# EAGLE design avr002 (EAGLE 6.5.0)
test
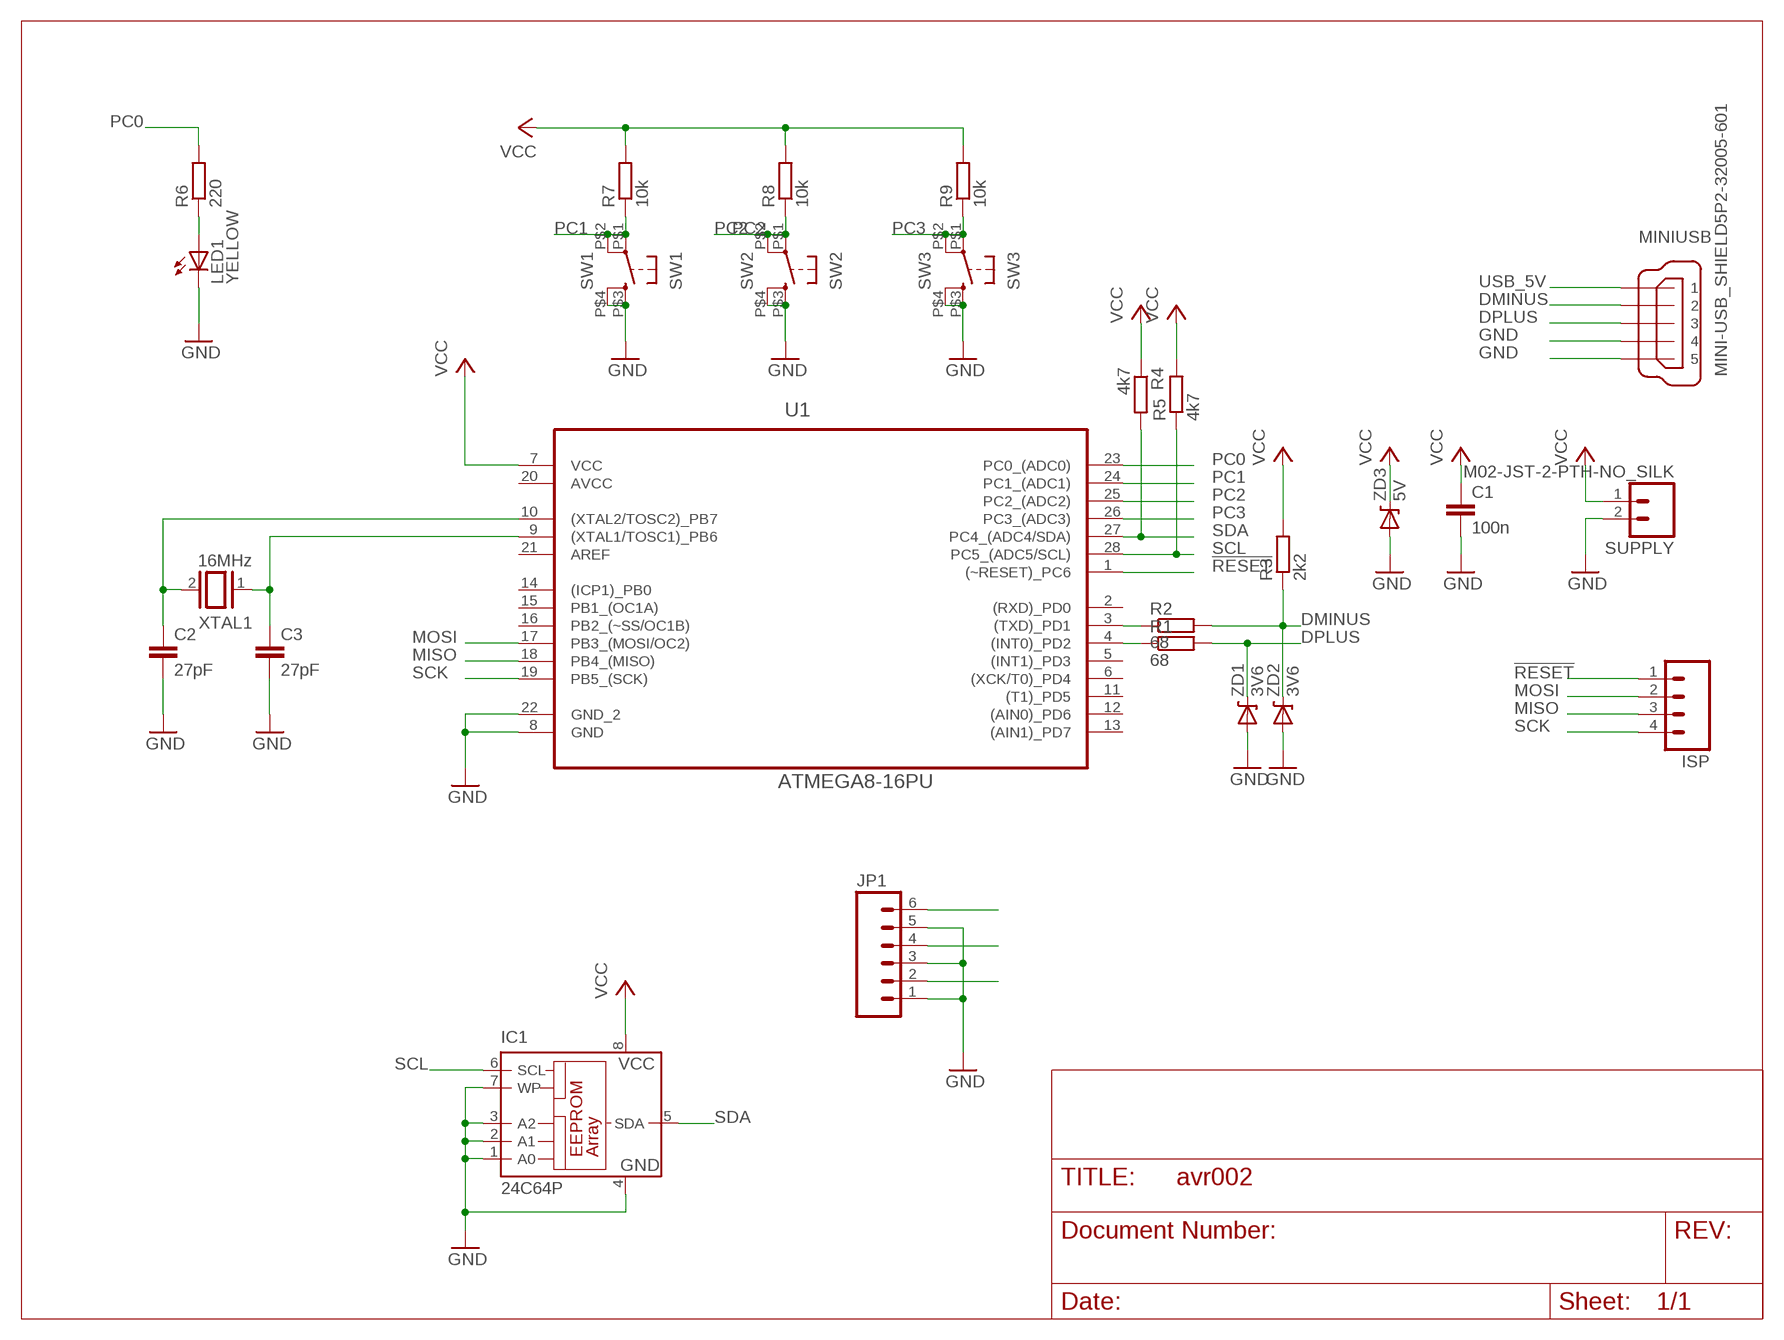
[diagram p0: schematic, sheet 1]

## Parts
C1  100n  C-EU050-024X044  [C050-024X044]
C2  27pF  C-EU050-024X044  [C050-024X044]
C3  27pF  C-EU050-024X044  [C050-024X044]
IC1  24C64P  [DIL8]
ISP  M04POLAR  [MOLEX-1X4]
JP1  M06POLAR  [MOLEX-1X6]
LED1  YELLOW  LED5MM  [LED5MM]
MINIUSB  MINI-USB_SHIELD5P2-32005-601  [32005-601]
R1  68  R-EU_0204/7  [0204/7]
R2  68  R-EU_0204/7  [0204/7]
R3  2k2  R-EU_0204/7  [0204/7]
R4  4k7  R-EU_0204/7  [0204/7]
R5  4k7  R-EU_0204/7  [0204/7]
R6  220  R-EU_0204/7  [0204/7]
R7  10k  R-EU_0204/7  [0204/7]
R8  10k  R-EU_0204/7  [0204/7]
R9  10k  R-EU_0204/7  [0204/7]
SUPPLY  M02-JST-2-PTH-NO_SILK  [JST-2-PTH-NS]
SW1  SW1  TAC_SWITCHKSA_SEALED  [KSA_SEALED_TAC_SWITCH]
SW2  SW2  TAC_SWITCHKSA_SEALED  [KSA_SEALED_TAC_SWITCH]
SW3  SW3  TAC_SWITCHKSA_SEALED  [KSA_SEALED_TAC_SWITCH]
U1  ATMEGA8-16PU  [DIP254P762X457-28]
XTAL1  16MHz  XTAL  [Q]
ZD1  3V6  DIODE-ZENERPTH  [DIODE-ZENER]
ZD2  3V6  DIODE-ZENERPTH  [DIODE-ZENER]
ZD3  5V  DIODE-ZENERPTH  [DIODE-ZENER]

## Nets
!RESET: ISP.1 U1.1((~RESET)_PC6)
DMINUS: MINIUSB.2 R2.2 R3.1 ZD2.P$1(C)
DPLUS: MINIUSB.3 R1.2 ZD1.P$1(C)
GND: C1.2 C2.2 C3.2 IC1.1(A0) IC1.2(A1) IC1.3(A2) IC1.4(GND) IC1.7(WP) JP1.1 JP1.3 JP1.5 LED1.K(C) MINIUSB.4 MINIUSB.5 SUPPLY.2 SW1.P$3 SW1.P$4 SW2.P$3 SW2.P$4 SW3.P$3 SW3.P$4 U1.8(GND) U1.22(GND_2) ZD1.P$2(A) ZD2.P$2(A) ZD3.P$2(A)
MISO: ISP.3 U1.18(PB4_(MISO))
MOSI: ISP.2 U1.17(PB3_(MOSI/OC2))
N$1: R1.1 U1.4((INT0)_PD2)
N$2: R2.1 U1.3((TXD)_PD1)
N$3: C2.1 U1.10((XTAL2/TOSC2)_PB7) XTAL1.2
N$4: C3.1 U1.9((XTAL1/TOSC1)_PB6) XTAL1.1
N$6: LED1.A R6.1
PC0: R6.2 U1.23(PC0_(ADC0))
PC1: JP1.2 R7.1 SW1.P$1 SW1.P$2 U1.24(PC1_(ADC1))
PC2: JP1.4 R8.1 SW2.P$1 SW2.P$2 U1.25(PC2_(ADC2))
PC3: JP1.6 R9.1 SW3.P$1 SW3.P$2 U1.26(PC3_(ADC3))
SCK: ISP.4 U1.19(PB5_(SCK))
SCL: IC1.6(SCL) R5.1 U1.28(PC5_(ADC5/SCL))
SDA: IC1.5(SDA) R4.2 U1.27(PC4_(ADC4/SDA))
USB_5V: MINIUSB.1
VCC: C1.1 IC1.8(VCC) R3.2 R4.1 R5.2 R7.2 R8.2 R9.2 SUPPLY.1 U1.7(VCC) ZD3.P$1(C)
Unconnected: MINIUSB.M1(S1) MINIUSB.M2(S2) U1.2((RXD)_PD0) U1.5((INT1)_PD3) U1.6((XCK/T0)_PD4) U1.11((T1)_PD5) U1.12((AIN0)_PD6) U1.13((AIN1)_PD7) U1.14((ICP1)_PB0) U1.15(PB1_(OC1A)) U1.16(PB2_(~SS/OC1B)) U1.21(AREF)

## Power pins joined to a net without a drawn wire
AVCC: U1.20(AVCC)

## Library data of the parts
C1-C3 = resistor:C-EU: CAPACITOR, European symbol
IC1 = microchip:24*: Serial EEPROM I2C; MF: RAMTRON INTERNATIONAL CORP; MPN: FM24C64-P; OC_FARNELL: 1362657; OC_NEWARK: 97H6452
ISP = SparkFun-Connectors:M04: Header 4 Standard 4-pin 0.1" header. Use with straight break away headers (SKU : PRT-00116), right angle break away headers (PRT-00553), swiss pins (PRT-00743), machine pins (PRT-00117), and female headers (PRT-00115). Molex polarized connector foot print use with SKU : PRT-08231 with associated crimp pins and housings. 1MM SMD Version SKU: PRT-10208
JP1 = SparkFun-Connectors:M06: Header 6 Standard 6-pin 0.1" header. Use with straight break away headers (SKU : PRT-00116), right angle break away headers (PRT-00553), swiss pins (PRT-00743), machine pins (PRT-00117), and female headers (PRT-00115). Molex polarized connector foot print use with SKU : PRT-08094 with associated crimp pins and housings. NOTES ON THE VARIANTS LOCK and LOCK_LONGPADS... This footprint was designed to help hold the alignment of a through-hole component (i.e. 6-pin header) while soldering it into place. You may notice that each hole has been shifted either up or down by 0.005 of an inch from it's more standard position (which is a perfectly straight line). This slight alteration caused the pins (the squares in the middle) to touch the edges of the holes. Because they are alternating, it causes a "brace" to hold the component in place. 0.005 has proven to be the perfect amount of "off-center" position when using our standard breakaway headers. Although looks a little odd when you look at the bare footprint, once you have a header in there, the alteration is very hard to notice. Also,if you push a header all the way into place, it is covered up entirely on the bottom side. This idea of altering the position of holes to aid alignment will be further integrated into the Sparkfun Library for other footprints. It can help hold any component with 3 or more connection pins.
LED1 = led:LED: LED OSRAM: - CHIPLED LG R971, LG N971, LY N971, LG Q971, LY Q971, LO R971, LY R971 LH N974, LH R974 LS Q976, LO Q976, LY Q976 LO Q996 - Hyper CHIPLED LW Q18S LB Q993, LB Q99A, LB R99A - SideLED LS A670, LO A670, LY A670, LG A670, LP A670 LB A673, LV A673, LT A673, LW A673 LH A674 LY A675 LS A676, LA A676, LO A676, LY A676, LW A676 LS A679, LY A679, LG A679 - Hyper Micro SIDELED® LS Y876, LA Y876, LO Y876, LY Y876 LT Y87S - SmartLED LW L88C, LW L88S LB L89C, LB L89S, LG L890 LS L89K, LO L89K, LY L89K LS L896, LA L896, LO L896, LY L896 - TOPLED LS T670, LO T670, LY T670, LG T670, LP T670 LSG T670, LSP T670, LSY T670, LOP T670, LYG T670 LG T671, LOG T671, LSG T671 LB T673, LV T673, LT T673, LW T673 LH T674 LS T676, LA T676, LO T676, LY T676, LB T676, LH T676, LSB T676, LW T676 LB T67C, LV T67C, LT T67C, LS T67K, LO T67K, LY T67K, LW E67C LS E67B, LA E67B, LO E67B, LY E67B, LB E67C, LV E67C, LT E67C LW T67C LS T679, LY T679, LG T679 LS T770, LO T770, LY T770, LG T770, LP T770 LB T773, LV T773, LT T773, LW T773 LH T774 LS E675, LA E675, LY E675, LS T675 LS T776, LA T776, LO T776, LY T776, LB T776 LHGB T686 LT T68C, LB T68C - Hyper Mini TOPLED® LB M676 - Mini TOPLED Santana® LG M470 LS M47K, LO M47K, LY M47K Source: http://www.osram.convergy.de LUXEON: - LUMILED® LXK2-PW12-R00, LXK2-PW12-S00, LXK2-PW14-U00, LXK2-PW14-V00 LXK2-PM12-R00, LXK2-PM12-S00, LXK2-PM14-U00 LXK2-PE12-Q00, LXK2-PE12-R00, LXK2-PE12-S00, LXK2-PE14-T00, LXK2-PE14-U00 LXK2-PB12-K00, LXK2-PB12-L00, LXK2-PB12-M00, LXK2-PB14-N00, LXK2-PB14-P00, LXK2-PB14-Q00 LXK2-PR12-L00, LXK2-PR12-M00, LXK2-PR14-Q00, LXK2-PR14-R00 LXK2-PD12-Q00, LXK2-PD12-R00, LXK2-PD12-S00 LXK2-PH12-R00, LXK2-PH12-S00 LXK2-PL12-P00, LXK2-PL12-Q00, LXK2-PL12-R00 Source: www.luxeon.com KINGBRIGHT: KA-3528ASYC Source: www.kingbright.com
MINIUSB = con-cypressindustries:MINI-USB_SHIELD5P2-: MINI USB-B R/A DIP 5pol. Source: www.cypressindustries.com; OC_FARNELL: unknown; OC_NEWARK: unknown
R1-R9 = resistor:R-EU_: RESISTOR, European symbol
SUPPLY = SparkFun-Connectors:M02: Standard 2-pin 0.1" header. Use with - straight break away headers ( PRT-00116) - right angle break away headers (PRT-00553) - swiss pins (PRT-00743) - machine pins (PRT-00117) - female headers (PRT-00115) Molex polarized connector foot print use with: PRT-08233 with associated crimp pins and housings. 2.54_SCREWTERM for use with PRT-10571. 3.5mm Screw Terminal footprints for PRT-08084 5mm Screw Terminal footprints for use with PRT-08433
SW1-SW3 = SparkFun-Electromechanical:TAC_SWITCH: Momentary Switch Button commonly used for reset or general input. Spark Fun Electronics SKU : COM-00097 SMT- SWCH-08247
U1 = Atmel_By_element14_Batch_1-00:ATMEGA8-16PU: Programmable Flash; DESCRIPTION: Programmable Flash; MPN: ATMEGA8-16PU; OC_FARNELL: 9171380; OC_NEWARK: 01M6901; PACKAGE: PCDIP-28; SUPPLIER: ATMEL
XTAL1 = special:XTAL: CRYSTAL
ZD1-ZD3 = SparkFun-DiscreteSemi:DIODE-ZENER: Zener Diode Production Part - 8199 3.4V Zener Voltage

## Board
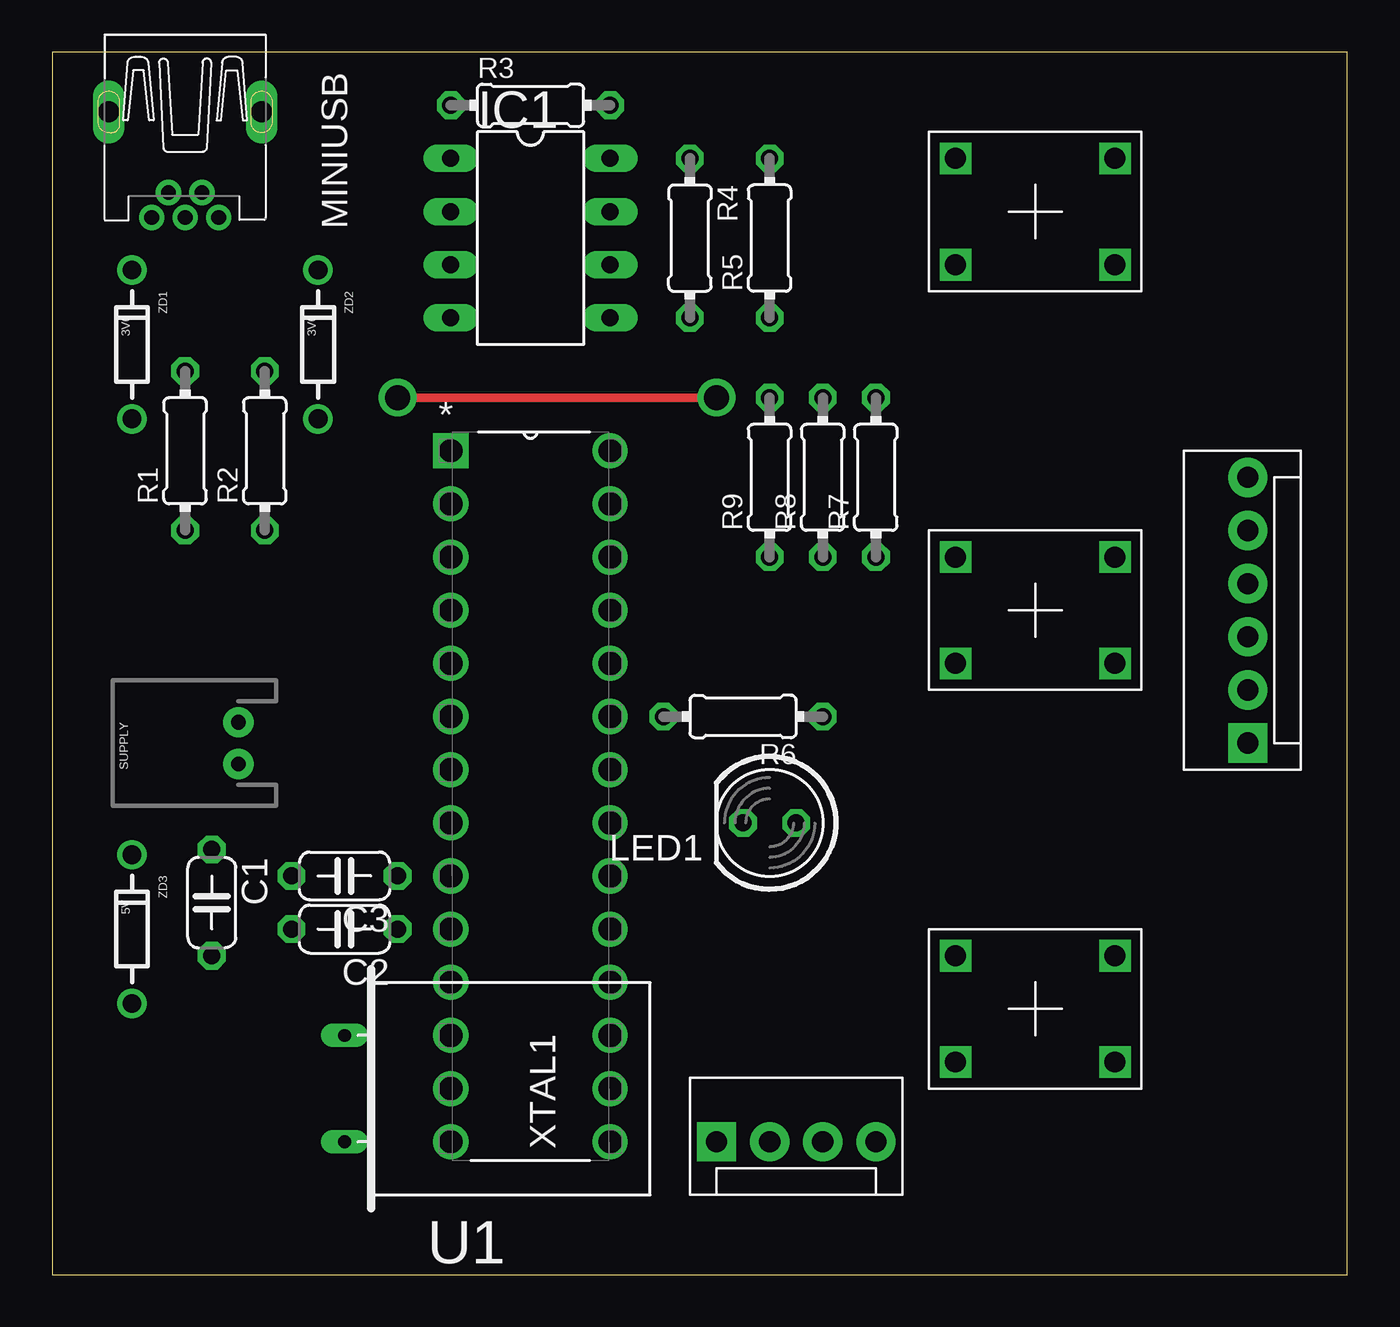
[diagram p1: board, top side]
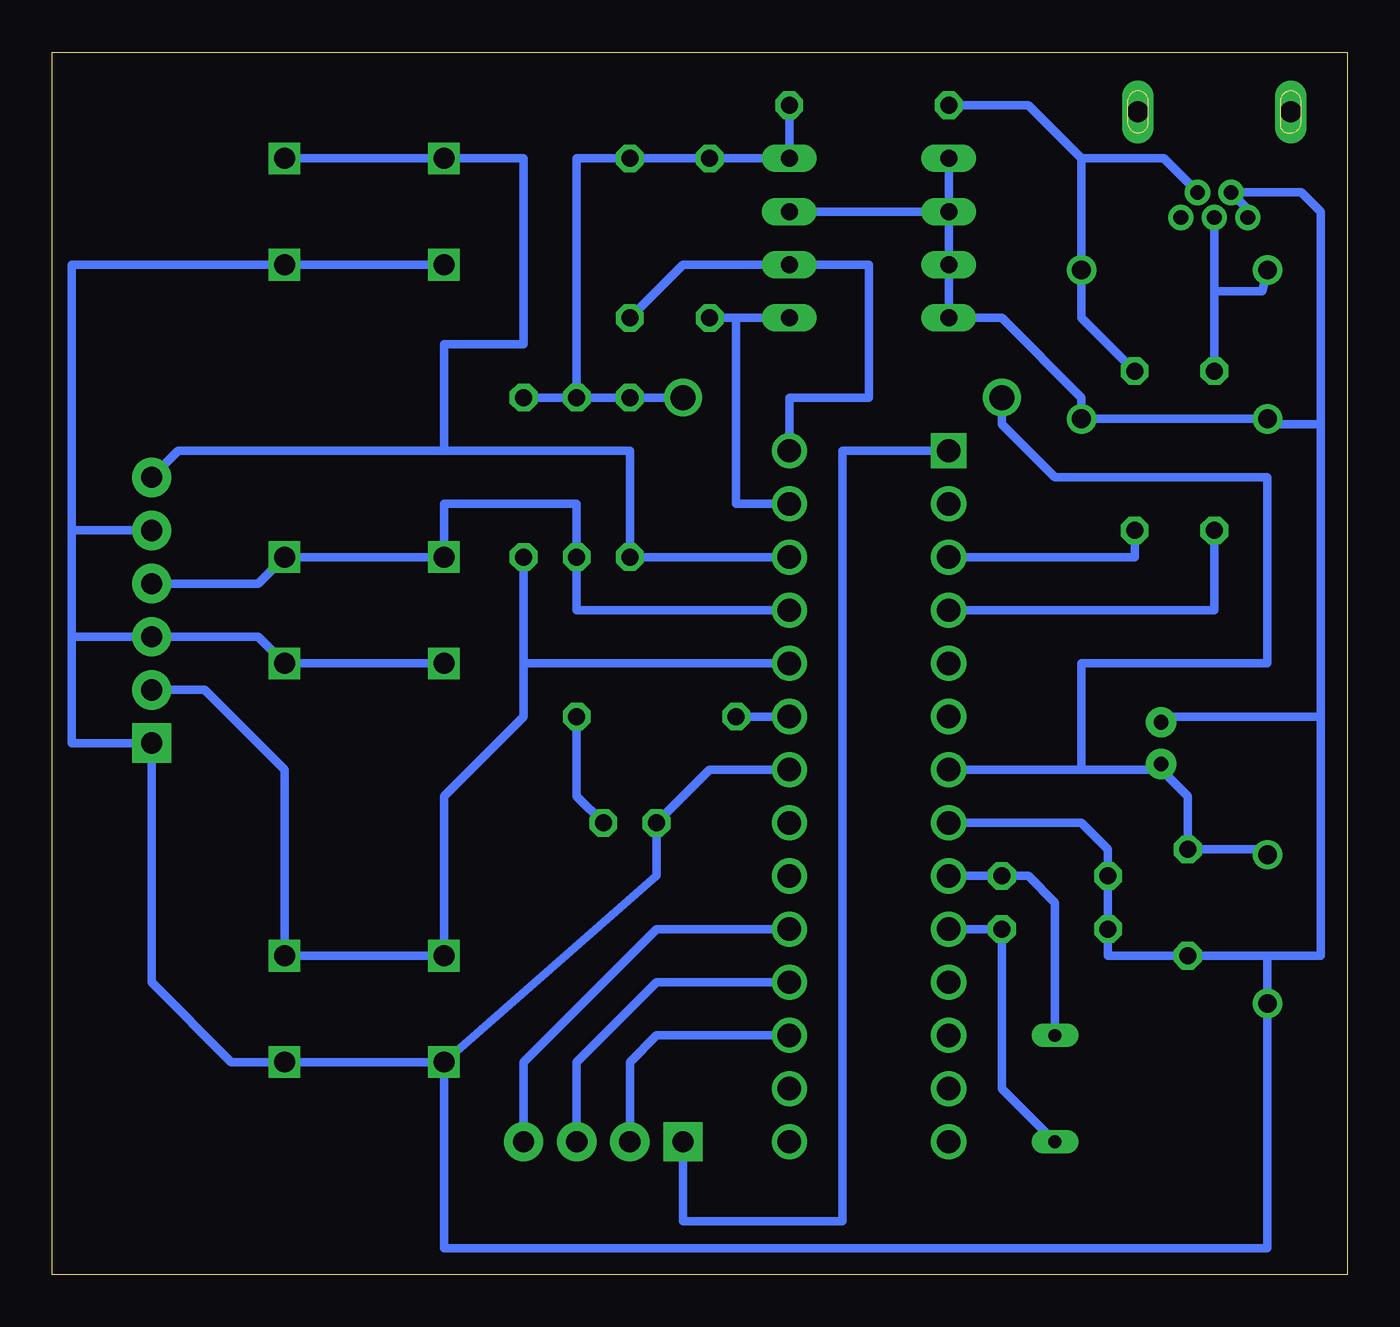
[diagram p2: board, bottom side, seen from below]

Size 61.9 x 58.41 mm. Coordinates in mm from the lower left corner, seen from the top.
Outline: 0,0 61.9,0 61.9,58.41 0,58.41 0,0
Copper layers (1*16): Top 0.035mm / dielectric 1.5mm / Bottom 0.035mm
Design rules "default": minimum track width 10mil, minimum drill 24mil, track to track 8mil, track to pad 8mil, pad to pad 8mil, via to via 8mil, smd to smd 8mil, copper to edge 40mil, drill to drill 8mil, minimum pad ring 10mil, minimum via ring 8mil, stop-mask expansion 4mil, vias tented up to drill 0mil, thermal gap 10mil

### Footprints (pad centres in the part's own frame; a part is rotated, then mirrored left to right if it is on the bottom)
C050-024X044 = drill 0.813 octagon: 1 -2.54,0; 2 2.54,0
DIL8 = drill 0.813 long: 1 -3.81,-3.81; 2 -1.27,-3.81; 3 1.27,-3.81; 4 3.81,-3.81; 5 3.81,3.81; 6 1.27,3.81; 7 -1.27,3.81; 8 -3.81,3.81
MOLEX-1X4 = drill 1.016 pad 1.88 square: 1 0,0 | drill 1.016 pad 1.88: 2 2.54,0; 3 5.08,0; 4 7.62,0
MOLEX-1X6 = drill 1.016 pad 1.88 square: 1 0,0 | drill 1.016 pad 1.88: 2 2.54,0; 3 5.08,0; 4 7.62,0; 5 10.16,0; 6 12.7,0
LED5MM = drill 0.813 octagon: A -1.27,0; K 1.27,0
32005-601 = drill 0.7 pad 1.016: 1 2.825,1.6; 2 1.625,0.8; 3 2.825,0; 4 1.625,-0.8; 5 2.825,-1.6 | drill 1 pad 1.422 long: M1 -2.225,3.65; M2 -2.225,-3.65
0204/7 = drill 0.813 octagon: 1 -3.81,0; 2 3.81,0
JST-2-PTH-NS = drill 0.7 pad 1.448: 1 -1,0; 2 1,0
KSA_SEALED_TAC_SWITCH = drill 1 square: P$1 -3.81,2.54; P$2 3.81,2.54; P$3 -3.81,-2.54; P$4 3.81,-2.54
DIP254P762X457-28 = drill 1.118 square: 1 -7.62,33.02 | drill 1.118: 2 -7.62,30.48; 3 -7.62,27.94; 4 -7.62,25.4; 5 -7.62,22.86; 6 -7.62,20.32; 7 -7.62,17.78; 8 -7.62,15.24; 9 -7.62,12.7; 10 -7.62,10.16; 11 -7.62,7.62; 12 -7.62,5.08; 13 -7.62,2.54; 14 -7.62,0; 15 0,0; 16 0,2.54; 17 0,5.08; 18 0,7.62; 19 0,10.16; 20 0,12.7; 21 0,15.24; 22 0,17.78; 23 0,20.32; 24 0,22.86; 25 0,25.4; 26 0,27.94; 27 0,30.48; 28 0,33.02
Q = drill 0.61 long: 1 -2.54,-7.62; 2 2.54,-7.62
DIODE-ZENER = drill 0.9: P$1 -3.556,0; P$2 3.556,0

### Placement (x,y rotation side)
C1  7.62,17.78 270 top
C2  13.97,16.51 180 top
C3  13.97,19.05 180 top
IC1  22.86,49.53 270 top
ISP  31.75,6.35 0 top
JP1  57.15,25.4 90 top
LED1  34.29,21.59 180 top
MINIUSB  6.35,53.34 270 top
R1  6.35,39.37 90 top
R2  10.16,39.37 90 top
R3  22.86,55.88 0 top
R4  30.48,49.53 270 top
R5  34.29,49.53 90 top
R6  33.02,26.67 180 top
R7  39.37,38.1 90 top
R8  36.83,38.1 90 top
R9  34.29,38.1 90 top
SUPPLY  8.89,25.4 90 top
SW1  46.99,12.7 0 top
SW2  46.99,31.75 0 top
SW3  46.99,50.8 0 top
U1  26.67,6.35 0 top
XTAL1  21.59,8.89 270 top
ZD1  3.81,44.45 270 top
ZD2  12.7,44.45 270 top
ZD3  3.81,16.51 270 top

### Tracks (layer width: path | path; a pad name or v marks a point on that pad's centre or on a via)
!RESET
  Bottom 0.406: U1.1 24.13,39.37 24.13,2.54 31.75,2.54 ISP.1
DMINUS
  Bottom 0.406: MINIUSB.2 8.78,53.34 12.7,53.34 | 12.7,53.34 15.24,55.88 R3.1 | R2.2 12.7,45.72 ZD2.P$1 12.7,53.34
DPLUS
  Bottom 0.406: MINIUSB.3 6.35,46.99 | 6.35,46.99 R1.2 | ZD1.P$1 4.06,46.99 6.35,46.99
GND
  Bottom 0.406: SW1.P$3 SW1.P$4 53.34,10.16 57.15,13.97 JP1.1 60.96,25.4 60.96,30.48 | SW2.P$3 SW2.P$4 52.07,30.48 JP1.3 60.96,30.48 | SW3.P$3 SW3.P$4 60.96,48.26 60.96,35.56 | U1.22 30.48,24.13 LED1.K 33.02,19.05 SW1.P$3 | MINIUSB.5 4.75,50.91 MINIUSB.4 2.18,51.71 1.27,50.8 1.27,40.64 | IC1.1 IC1.2 | IC1.2 IC1.3 IC1.4 16.51,45.72 12.7,41.91 ZD2.P$2 ZD1.P$2 3.56,40.64 1.27,40.64 | SW1.P$3 43.18,1.27 3.81,1.27 ZD3.P$2 3.81,15.24 | 3.81,15.24 C1.2 11.43,15.24 C2.2 C3.2 11.43,20.32 12.7,21.59 U1.8 | SUPPLY.2 8.62,26.67 1.27,26.67 | 1.27,26.67 1.27,15.24 3.81,15.24 | 1.27,26.67 1.27,40.64 | 60.96,30.48 60.96,35.56 | JP1.5 60.96,35.56 | IC1.2 IC1.7
MISO
  Bottom 0.406: U1.18 33.02,13.97 36.83,10.16 ISP.3
MOSI
  Bottom 0.406: U1.17 33.02,11.43 34.29,10.16 ISP.2
N$1
  Bottom 0.406: R1.1 6.35,31.75 U1.4
N$2
  Bottom 0.406: R2.1 10.16,34.29 U1.3
N$3
  Bottom 0.406: U1.10 C2.1 16.51,8.89 XTAL1.2
N$4
  Bottom 0.406: U1.9 C3.1 15.24,19.05 13.97,17.78 XTAL1.1
N$6
  Bottom 0.406: LED1.A 36.83,22.86 R6.1
PC0
  Bottom 0.406: U1.23 R6.2
PC1
  Bottom 0.406: U1.24 39.37,29.21 | 39.37,29.21 R7.1 | 39.37,29.21 39.37,26.67 43.18,22.86 SW1.P$1 SW1.P$2 50.8,24.13 54.61,27.94 JP1.2
PC2
  Bottom 0.406: U1.25 36.83,31.75 R8.1 36.83,36.83 43.18,36.83 SW2.P$1 SW2.P$2 52.07,33.02 JP1.4
PC3
  Bottom 0.406: SW3.P$2 SW3.P$1 39.37,53.34 39.37,44.45 43.18,44.45 43.18,39.37 | U1.26 R9.1 34.29,39.37 43.18,39.37 | 43.18,39.37 55.88,39.37 JP1.6
SCK
  Bottom 0.406: U1.19 33.02,16.51 39.37,10.16 ISP.4
SCL
  Bottom 0.406: R5.1 31.75,48.26 IC1.6 22.86,48.26 22.86,41.91 26.67,41.91 U1.28
SDA
  Bottom 0.406: R4.2 29.21,45.72 | 29.21,45.72 IC1.5 | U1.27 29.21,36.83 29.21,45.72
VCC  (via drill 1.2)
  Top 0.406: v16.51,41.91 v31.75,41.91
  Bottom 0.406: R3.2 IC1.8 R4.1 R5.2 36.83,53.34 R8.2 | R7.2 R8.2 | R8.2 R9.2 v31.75,41.91 | 12.7,24.13 9.16,24.13 SUPPLY.1 8.89,24.13 7.62,22.86 C1.1 4.06,20.32 ZD3.P$1 | 12.7,24.13 U1.7 | 12.7,24.13 12.7,29.21 3.81,29.21 3.81,38.1 13.97,38.1 16.51,40.64 v16.51,41.91